# EAGLE design esp12e (EAGLE 6.5.0)
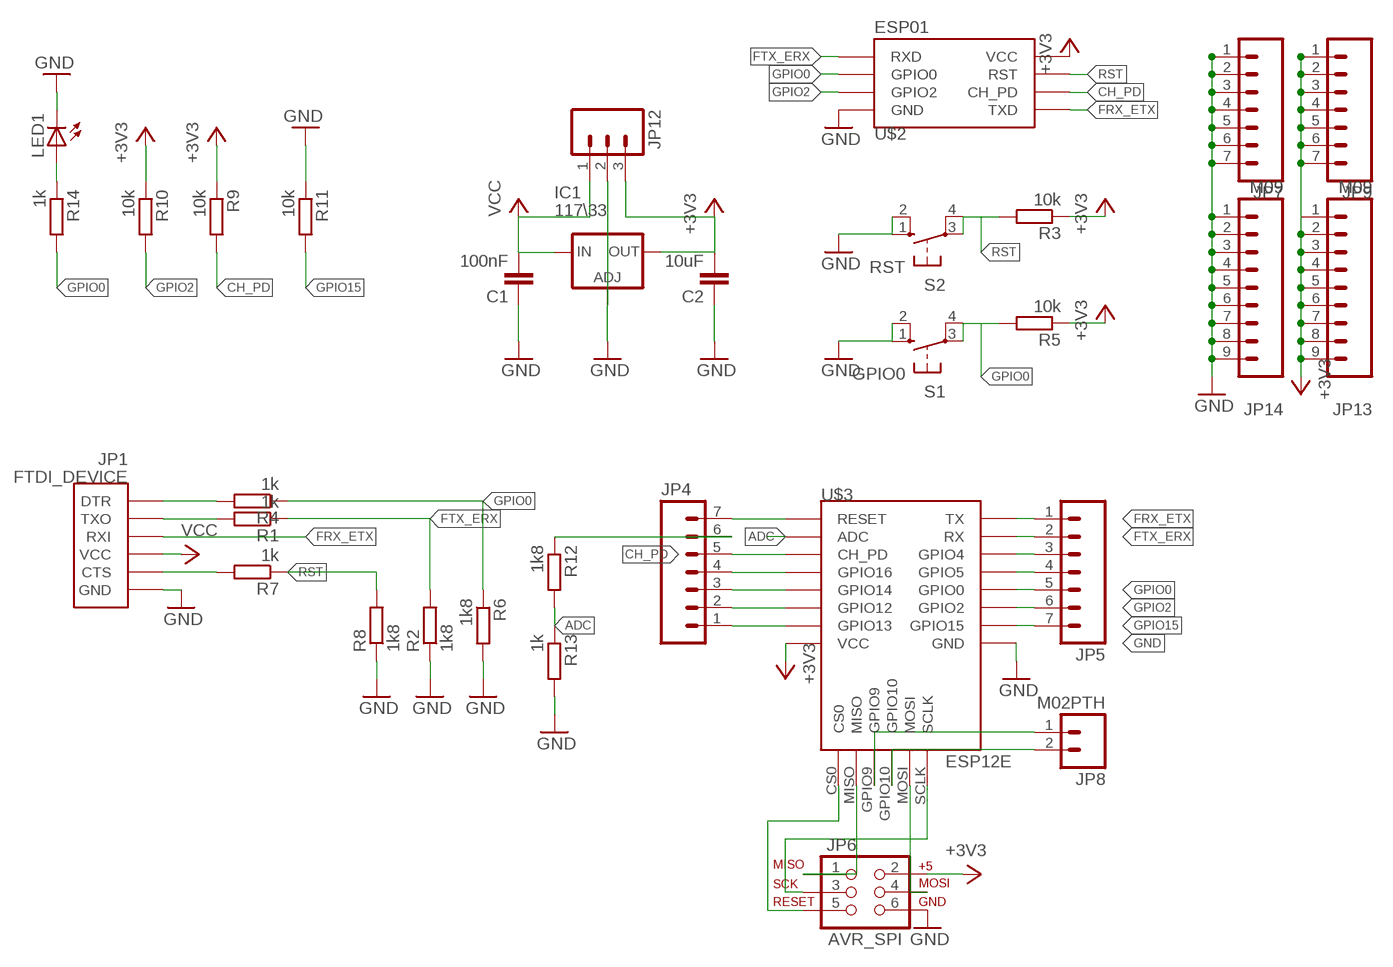
[diagram p0: schematic, sheet 1]

## Parts
C1  100nF  C-EUC1206  [C1206]
C2  10uF  C-EUC1206  [C1206]
IC1  117\33  LD117AS33TR  [SOT223]
JP1  FTDI_DEVICE  [FTDI_DEVICE_SIDE]
JP4  M07  [1X07]
JP5  M07  [1X07]
JP6  AVR_SPI  AVR_SPI_PRG_6NS  [2X3-NS]
JP7  M07  [1X07]
JP8  M02PTH  [1X02]
JP9  M07  [1X07]
JP12  M03PTH  [1X03]
JP13  M09  [1X09]
JP14  M09  [1X09]
LED1  LEDSMT1206  [1206]
R1  1k  R-EU_M1206  [M1206]
R2  1k8  R-EU_M1206  [M1206]
R3  10k  R-EU_M1206  [M1206]
R4  1k  R-EU_M1206  [M1206]
R5  10k  R-EU_M1206  [M1206]
R6  1k8  R-EU_M1206  [M1206]
R7  1k  R-EU_M1206  [M1206]
R8  1k8  R-EU_M1206  [M1206]
R9  10k  R-EU_M1206  [M1206]
R10  10k  R-EU_M1206  [M1206]
R11  10k  R-EU_M1206  [M1206]
R12  1k8  R-EU_M1206  [M1206]
R13  1k  R-EU_M1206  [M1206]
R14  1k  R-EU_M1206  [M1206]
S1  GPIO0  10-XX  [B3F-10XX]
S2  RST  10-XX  [B3F-10XX]
U$2  ESP01  [ESP01]
U$3  ESP12E  [ESP12E]

## Nets
+3V3: C2.2 IC1.4(OUT) JP6.2 JP9.1 JP9.2 JP9.3 JP9.4 JP9.5 JP9.6 JP9.7 JP12.3 JP13.1 JP13.2 JP13.3 JP13.4 JP13.5 JP13.6 JP13.7 JP13.8 JP13.9 R3.1 R5.1 R9.1 R10.1 U$2.VCC U$3.VCC
ADC: R12.2 R13.1 U$3.ADC
CH_PD: JP4.5 R9.2 U$2.CH_PD U$3.CH_PD
FRX_ETX: JP1.P$3(RXI) JP5.1 U$2.TX(TXD) U$3.TX
FTX_ERX: JP5.2 R1.1 R2.2 U$2.RX(RXD) U$3.RX
GND: C1.1 C2.1 IC1.1(ADJ) JP1.P$6(GND) JP6.6 JP7.1 JP7.2 JP7.3 JP7.4 JP7.5 JP7.6 JP7.7 JP12.2 JP14.1 JP14.2 JP14.3 JP14.4 JP14.5 JP14.6 JP14.7 JP14.8 JP14.9 LED1.C R2.1 R6.2 R8.1 R11.1 R13.2 S1.1(S) S1.2(S1) S2.1(S) S2.2(S1) U$2.GND U$3.GND
GPIO0: JP5.5 R4.1 R5.2 R6.1 R14.2 S1.3(P) S1.4(P1) U$2.GPIO0 U$3.GPIO0
GPIO2: JP5.6 R10.2 U$2.GPIO2 U$3.GPIO2
GPIO15: JP5.7 R11.2 U$3.GPIO15
N$1: JP1.P$5(CTS) R7.2
N$2: JP1.P$2(TXO) R1.2
N$3: JP4.1 U$3.GPIO13
N$4: JP4.2 U$3.GPIO12
N$5: JP4.3 U$3.GPIO14
N$6: JP1.P$1(DTR) R4.2
N$7: JP4.4 U$3.GPIO16
N$8: LED1.A R14.1
N$9: JP4.6 R12.1
N$10: JP6.1 U$3.MISO
N$11: JP6.4 U$3.MOSI
N$12: JP6.3 U$3.SCLK
N$13: JP6.5 U$3.CS0
N$14: JP5.4 U$3.GPIO5
N$15: JP5.3 U$3.GPIO4
N$16: JP8.1 U$3.GPIO9
N$17: JP8.2 U$3.GPIO10
RST: JP4.7 R3.2 R7.1 R8.2 S2.3(P) S2.4(P1) U$2.RST U$3.RESET
VCC: C1.2 IC1.3(IN) JP1.P$4(VCC) JP12.1

## Library data of the parts
C1 C2 = resistor:C-EU: CAPACITOR, European symbol
IC1 = v-reg:LD117A?*: Low drop fixed and adjustable positive voltage regulators 1 A Source: http://www.st.com/stonline/products/literature/ds/7194/ld1117axx.pdf
JP1 = SparkFun-Connectors:FTDI_DEVICE: Connector which mates to FTDI basic or FTDI cable.
JP4 JP5 JP7 JP9 = SparkFun-Connectors:M07: Header 7 Standard 7-pin 0.1" header. Use with straight break away headers (SKU : PRT-00116), right angle break away headers (PRT-00553), swiss pins (PRT-00743), machine pins (PRT-00117), and female headers (PRT-00115). NOTES ON THE VARIANTS LOCK and LOCK_LONGPADS... This footprint was designed to help hold the alignment of a through-hole component (i.e. 7-pin header) while soldering it into place. You may notice that each hole has been shifted either up or down by 0.005 of an inch from it's more standard position (which is usually a perfectly straight line). This slight alteration caused the pins (the squares in the middle) to touch the edges of the holes. Because they are alternating, it causes a "brace" to hold the header in place. 0.005 has proven to be the perfect amount of "off-center" position when using our standard breakaway headers. Although looks a little odd when you look at the bare footprint, once you have a header in there, the alteration is very hard to notice. Also, if you push a header all the way into place, it is covered up entirely on the bottom side. This idea of altering the position of holes to aid alignment will be further integrated into the Sparkfun Library for other footprints. It can help hold any component with 3 or more connection pins.
JP6 = SparkFun-Connectors:AVR_SPI_PRG_6: AVR ISP 6 Pin This is the reduced ISP connector for AVR programming. Common on Arduino. This footprint will take up less PCB space and can be used with a 10-pin to 6-pin adapter such as SKU: BOB-08508 **Special note about "TEST_POINT" package. The stop mask is on the top side, so if you want your programming test points to be on the bottom of your board, make sure to place this package on the bottom side of the board. This also ensure that the orientation to program from the bottom side will be correct.
JP8 = SparkFun-Connectors:M02: Standard 2-pin 0.1" header. Use with - straight break away headers ( PRT-00116) - right angle break away headers (PRT-00553) - swiss pins (PRT-00743) - machine pins (PRT-00117) - female headers (PRT-00115) Molex polarized connector foot print use with: PRT-08233 with associated crimp pins and housings. 2.54_SCREWTERM for use with PRT-10571. 3.5mm Screw Terminal footprints for PRT-08084 5mm Screw Terminal footprints for use with PRT-08432
JP12 = SparkFun-Connectors:M03: Header 3 Standard 3-pin 0.1" header. Use with straight break away headers (SKU : PRT-00116), right angle break away headers (PRT-00553), swiss pins (PRT-00743), machine pins (PRT-00117), and female headers (PRT-00115). Molex polarized connector foot print use with SKU : PRT-08232 with associated crimp pins and housings.
JP13 JP14 = SparkFun-Connectors:M09: Header 9 Standard 9-pin 0.1" header. Use with straight break away headers (SKU : PRT-00116), right angle break away headers (PRT-00553), swiss pins (PRT-00743), machine pins (PRT-00117), and female headers (PRT-00115).
LED1 = led:LED: LED OSRAM: - CHIPLED LG R971, LG N971, LY N971, LG Q971, LY Q971, LO R971, LY R971 LH N974, LH R974 LS Q976, LO Q976, LY Q976 LO Q996 - Hyper CHIPLED LW Q18S LB Q993, LB Q99A, LB R99A - SideLED LS A670, LO A670, LY A670, LG A670, LP A670 LB A673, LV A673, LT A673, LW A673 LH A674 LY A675 LS A676, LA A676, LO A676, LY A676, LW A676 LS A679, LY A679, LG A679 - Hyper Micro SIDELED® LS Y876, LA Y876, LO Y876, LY Y876 LT Y87S - SmartLED LW L88C, LW L88S LB L89C, LB L89S, LG L890 LS L89K, LO L89K, LY L89K LS L896, LA L896, LO L896, LY L896 - TOPLED LS T670, LO T670, LY T670, LG T670, LP T670 LSG T670, LSP T670, LSY T670, LOP T670, LYG T670 LG T671, LOG T671, LSG T671 LB T673, LV T673, LT T673, LW T673 LH T674 LS T676, LA T676, LO T676, LY T676, LB T676, LH T676, LSB T676, LW T676 LB T67C, LV T67C, LT T67C, LS T67K, LO T67K, LY T67K, LW E67C LS E67B, LA E67B, LO E67B, LY E67B, LB E67C, LV E67C, LT E67C LW T67C LS T679, LY T679, LG T679 LS T770, LO T770, LY T770, LG T770, LP T770 LB T773, LV T773, LT T773, LW T773 LH T774 LS E675, LA E675, LY E675, LS T675 LS T776, LA T776, LO T776, LY T776, LB T776 LHGB T686 LT T68C, LB T68C - Hyper Mini TOPLED® LB M676 - Mini TOPLED Santana® LG M470 LS M47K, LO M47K, LY M47K Source: http://www.osram.convergy.de LUXEON: - LUMILED® LXK2-PW12-R00, LXK2-PW12-S00, LXK2-PW14-U00, LXK2-PW14-V00 LXK2-PM12-R00, LXK2-PM12-S00, LXK2-PM14-U00 LXK2-PE12-Q00, LXK2-PE12-R00, LXK2-PE12-S00, LXK2-PE14-T00, LXK2-PE14-U00 LXK2-PB12-K00, LXK2-PB12-L00, LXK2-PB12-M00, LXK2-PB14-N00, LXK2-PB14-P00, LXK2-PB14-Q00 LXK2-PR12-L00, LXK2-PR12-M00, LXK2-PR14-Q00, LXK2-PR14-R00 LXK2-PD12-Q00, LXK2-PD12-R00, LXK2-PD12-S00 LXK2-PH12-R00, LXK2-PH12-S00 LXK2-PL12-P00, LXK2-PL12-Q00, LXK2-PL12-R00 Source: www.luxeon.com KINGBRIGHT: KA-3528ASYC Source: www.kingbright.com
R1-R14 = resistor:R-EU_: RESISTOR, European symbol
S1 S2 = switch-omron:10-XX: OMRON SWITCH; MPN: B3F-1000; OC_FARNELL: 176432; OC_NEWARK: 36M3542
U$2 = esp8266modules:ESP01: ESP8266 Wifi module 01
U$3 = esp8266modules:ESP12E

## Board
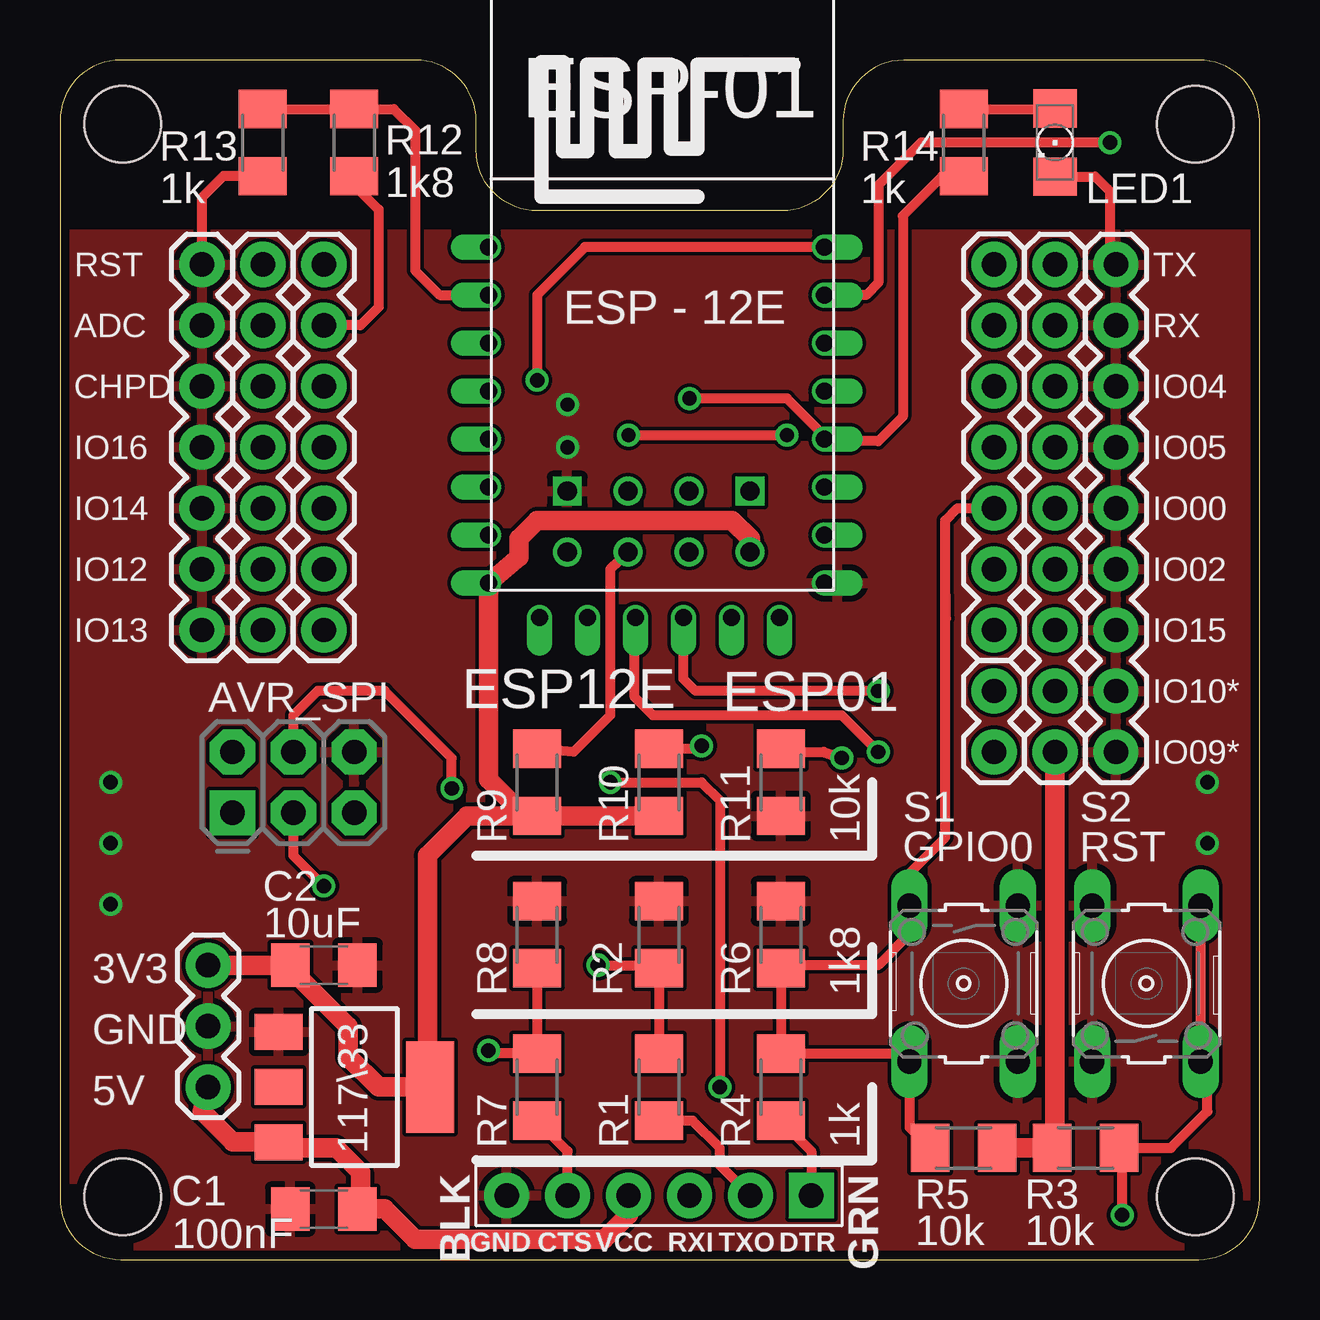
[diagram p1: board, top side]
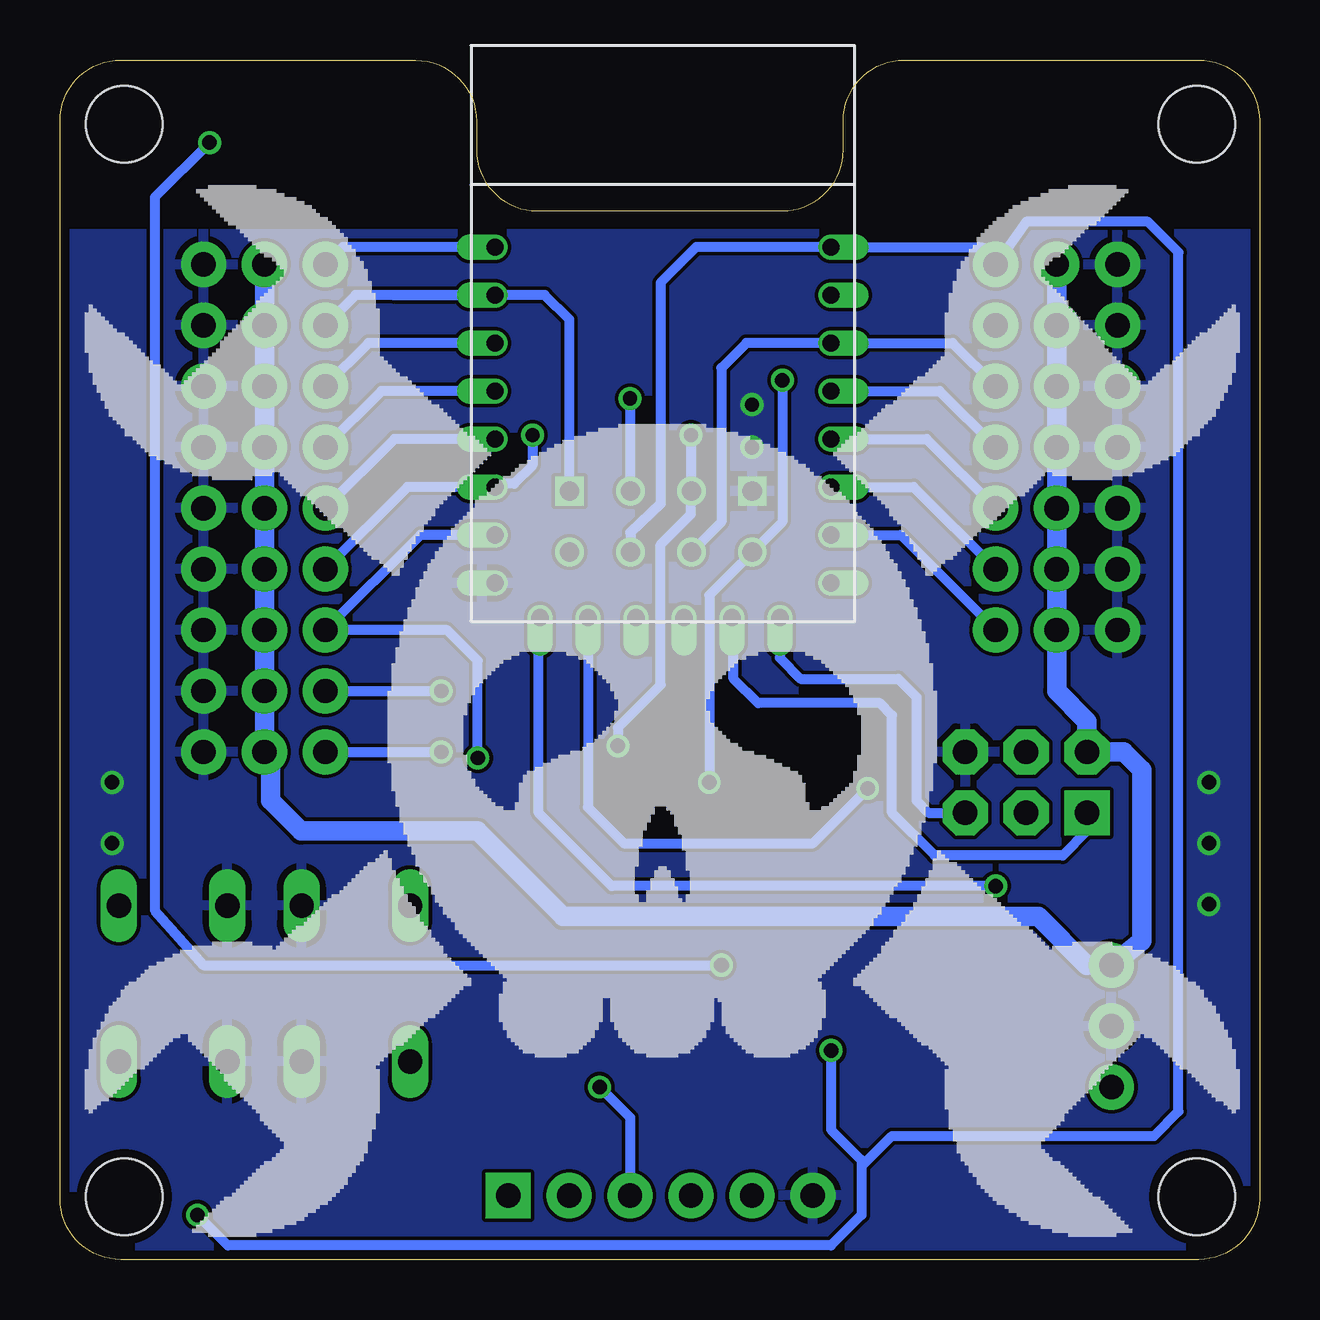
[diagram p2: board, bottom side, seen from below]

Size 50 x 50 mm. Coordinates in mm from the lower left corner, seen from the top.
Outline: 0,47.46 0,2.54 arc90 2.54,0 47.46,0 arc90 50,2.54 50,47.46 arc90 47.46,50 35.18,49.99 arc90 32.64,47.45 32.64,46.25 arc-90 30.1,43.71 19.89,43.71 arc-90 17.35,46.25 17.35,47.46 arc90 14.81,50 2.54,50 arc90 0,47.46
Copper layers (1*16): Top 0.0356mm / dielectric 1.5011mm / Bottom 0.0356mm
Design rules "LaenPCBOrder *": minimum track width 6mil, minimum drill 13mil, track to track 6mil, track to pad 6mil, pad to pad 6mil, via to via 6mil, smd to smd 6mil, copper to edge 15mil, drill to drill 6mil, minimum pad ring 7mil, minimum via ring 7mil, stop-mask expansion 3mil, vias tented up to drill 2000mil, thermal gap 10mil
Holes 3.2 mm at 2.62,47.32 2.62,2.62 47.32,2.62 47.32,47.32

### Footprints (pad centres in the part's own frame; a part is rotated, then mirrored left to right if it is on the bottom)
C1206 = smd 1.6 x 1.8: 1 -1.4,0; 2 1.4,0
SOT223 = smd 1.5 x 2: 1 -2.3,-3.15; 2 0,-3.15; 3 2.3,-3.15 | smd 3.8 x 2: 4 0,3.15
FTDI_DEVICE_SIDE = drill 1.016 pad 1.88 square: P$1 -6.35,0 | drill 1.016 pad 1.88: P$2 -3.81,0; P$3 -1.27,0; P$4 1.27,0; P$5 3.81,0; P$6 6.35,0
1X07 = drill 1.016 pad 1.88: 1 0,0; 2 2.54,0; 3 5.08,0; 4 7.62,0; 5 10.16,0; 6 12.7,0; 7 15.24,0
2X3-NS = drill 1.016 pad 1.88 square: 1 -2.54,-1.27 | drill 1.016 pad 1.88 octagon: 2 -2.54,1.27; 3 0,-1.27; 4 0,1.27; 5 2.54,-1.27; 6 2.54,1.27
1X02 = drill 1.016 pad 1.88: 1 0,0; 2 2.54,0
1X03 = drill 1.016 pad 1.88: 1 0,0; 2 2.54,0; 3 5.08,0
1X09 = drill 1.016 pad 1.88: 1 0,0; 2 2.54,0; 3 5.08,0; 4 7.62,0; 5 10.16,0; 6 12.7,0; 7 15.24,0; 8 17.78,0; 9 20.32,0
1206 = smd 1.6 x 1.803: A -1.422,0; C 1.422,0
M1206 = smd 1.6 x 2: 1 -1.4,0; 2 1.4,0
B3F-10XX = drill 1.016 long: 1 -3.251,2.261; 2 3.251,2.261; 3 -3.251,-2.261; 4 3.251,-2.261
ESP01 = drill 0.8: CH_PD -1.285,-8.178; GPIO0 1.255,-5.638; GPIO2 -1.285,-5.638; RST 1.255,-8.178; TX -3.825,-8.178; VCC 3.795,-8.178 | drill 0.8 square: GND -3.825,-5.638; RX 3.795,-5.638
ESP12E = drill 0.7 offset: ADC -7.1,3.8; CH_PD -7.1,1.8; CS0 -4.975,-9.64; GND 6.9,-8.2; GPIO0 6.9,-2.2; GPIO2 6.9,-4.2; GPIO4 6.9,1.8; GPIO5 6.9,-0.2; GPIO9 -0.975,-9.64; GPIO10 1.025,-9.64; GPIO12 -7.1,-4.2; GPIO13 -7.1,-6.2; GPIO14 -7.1,-2.2; GPIO15 6.9,-6.2; GPIO16 -7.1,-0.2; MISO -2.975,-9.64; MOSI 3.025,-9.64; RESET -7.1,5.8; RX 6.9,3.8; SCLK 5.025,-9.64; TX 6.9,5.8; VCC -7.1,-8.2

### Placement (x,y rotation side)
C1  11,2.11 0 top
C2  11,12.27 180 top
IC1  12.27,7.19 270 top
JP1  24.97,2.67 180 top
JP4  11,26.24 90 top
JP5  38.94,41.48 270 top
JP6  9.73,19.89 0 top
JP7  5.92,26.24 90 top
JP8  38.94,21.16 90 top
JP9  8.46,26.24 90 top
JP12  6.17,7.19 90 top
JP13  41.48,21.16 90 top
JP14  44.02,21.16 90 top
LED1  41.48,46.56 270 top
R1  24.97,7.19 270 top
R2  24.97,13.54 270 top
R3  42.75,4.65 0 top
R4  30.05,7.19 270 top
R5  37.67,4.65 180 top
R6  30.05,13.54 90 top
R7  19.89,7.19 270 top
R8  19.89,13.54 270 top
R9  19.89,19.89 90 top
R10  24.97,19.89 90 top
R11  30.05,19.89 90 top
R12  12.27,46.56 90 top
R13  8.46,46.56 270 top
R14  37.67,46.56 270 top
S1  37.67,11.51 270 top
S2  45.29,11.51 90 top
U$2  24.97,37.67 0 top
U$3  24.97,36.4 0 top

### Tracks (layer width: path | path; a pad name or v marks a point on that pad's centre or on a via)
+3V3
  Top 0.406: C2.2 9.6,12.14 | 41.48,4.78 R3.1 | R9.1 19.38,18.49 | 15.32,7.29 IC1.4
  Top 0.813: C2.2 JP12.3 | 9.6,12.14 12.01,9.73 12.01,8.46 13.28,7.19 IC1.4 | JP13.1 41.48,4.78 | R3.1 R5.1 | R10.1 R9.1 | 15.32,7.29 15.32,16.84 16.96,18.49 19.38,18.49 17.87,20 U$3.VCC 19.13,29.29 19.13,30.05 19.89,30.81 28.02,30.81 28.78,30.05 U$2.VCC
  Bottom 0.254: 39.95,17.86 40.21,17.86 41.48,19.13 JP13.1
  Bottom 0.406: 7.19,12.27 JP12.3
  Bottom 0.813: JP13.9 JP13.8 JP13.7 JP13.6 JP13.5 JP13.4 JP13.3 JP13.2 JP13.1 | 7.19,12.27 9.22,14.3 29.03,14.3 32.59,17.86 39.95,17.86 41.22,19.13 41.22,21.16 | JP9.7 JP9.6 JP9.5 JP9.4 JP9.3 JP9.2 JP9.1 8.46,23.7 7.19,22.43 JP6.2 5.66,21.16 4.9,20.4 4.9,13.28 JP12.3
ADC
  Top 0.406: R13.1 R12.2 13.92,47.96 14.81,47.07 14.81,41.22 15.82,40.21 U$3.ADC
CH_PD
  Top 0.406: U$2.CH_PD 22.94,28.78 22.94,22.68 21.41,21.16 R9.2
  Bottom 0.406: JP4.5 12.8,38.2 U$3.CH_PD 21.39,38.2 22.43,37.16 22.43,30.75 U$2.CH_PD
FRX_ETX  (via drill 0.6)
  Top 0.406: U$3.TX 21.88,42.2 19.89,40.21 v19.89,36.65 | v22.94,19.89 26.75,19.89 27.51,19.13 v27.51,7.19
  Bottom 0.406: U$3.TX 38.22,42.2 JP5.1 | v22.94,19.89 22.94,27.7 U$2.TX 19.89,30.75 v19.89,36.65 | v27.51,7.19 26.24,5.92 JP1.P$3
FTX_ERX  (via drill 0.6, 0.61)
  Top 0.254: 24.97,12.27 R2.2
  Top 0.406: R2.2 R1.1 | v22.43,12.27 24.97,12.27 | v43.76,46.56 35.89,46.56 34.11,44.78 34.11,40.72 33.6,40.2 U$3.RX
  Bottom 0.254: 36.14,40.21 37.67,40.21 37.67,40.2
  Bottom 0.406: JP5.2 37.68,40.2 37.67,40.2 U$3.RX 29.79,40.21 28.76,39.18 U$2.RX | v22.43,12.27 44.02,12.27 46.05,14.55 46.05,44.27 v43.76,46.56 | 36.14,40.21 32.59,40.21
GND  (via drill 0.6)
  Top 0.406: R13.2 6.8,45.16 5.92,44.27 JP7.7 | LED1.C 43.15,45.14 43.76,44.53 43.76,41.73 JP14.9 | R11.1 30.17,18.36 | 33.17,28.2 U$3.GND
  other vias: 21.16,35.64 21.16,33.86 2.11,17.35 2.11,19.89 2.11,14.81 47.83,17.35 47.83,19.89
  pour Top: -5.51,42.75 55.45,42.75 55.45,-5.51 -5.51,-5.51
  pour Bottom: -2.97,42.75 52.91,42.75 52.91,-2.97 -2.97,-2.97
GPIO0  (via drill 0.6)
  Top 0.406: R14.2 36.78,45.16 35.13,43.51 35.13,35.13 34.11,34.11 31.95,34.11 U$3.GPIO0 31.87,34.32 30.3,35.89 v26.24,35.89 | R5.2 35.41,5.51 S1.4 35.07,8.59 R4.1 R6.1 30.18,12.27 34.11,12.27 35.41,13.56 S1.3 35.41,16.1 36.91,17.6 36.91,28.78 | 36.93,26.72 36.91,28.78 | 36.91,28.78 36.91,30.81 37.41,31.32 38.18,31.32 38.56,31.7 JP5.5
  Bottom 0.406: U$3.GPIO0 36.06,34.2 JP5.5 | v26.24,35.89 26.24,32.05 U$2.GPIO0
GPIO2  (via drill 0.6)
  Top 0.406: v23.7,34.37 v30.3,34.37 | v26.75,21.41 26.62,21.29 R10.2
  Bottom 0.406: JP5.6 35.52,32.2 U$3.GPIO2 31.73,32.33 31.06,32.33 30.3,33.1 v30.3,34.37 | v23.7,34.37 23.68,34.35 U$2.GPIO2 23.7,31.06 24.97,29.79 24.97,23.95 26.75,22.17 v26.75,21.41
GPIO15  (via drill 0.6)
  Top 0.406: R11.2 30.18,21.16 31.83,21.16 v32.59,20.9
  Bottom 0.406: U$3.GPIO15 34.98,30.2 JP5.7 33.86,26.24 32.59,24.97 v32.59,20.9
N$1
  Top 0.406: JP1.P$5 21.16,4.52 R7.2
N$2
  Top 0.406: JP1.P$2 27.51,3.94 27.51,4.65 26.37,5.79 R1.2
N$3
  Bottom 0.406: U$3.GPIO13 14.96,30.2 JP4.1
N$4
  Bottom 0.406: U$3.GPIO12 14.42,32.2 JP4.2
N$5
  Bottom 0.406: U$3.GPIO14 13.88,34.2 JP4.3
N$6
  Top 0.406: R4.2 31.32,4.52 JP1.P$1
N$7
  Bottom 0.406: U$3.GPIO16 13.34,36.2 JP4.4
N$8
  Top 0.406: R14.1 41.46,47.96 LED1.A
N$9
  Top 0.406: R12.1 12.27,44.78 13.28,43.76 13.28,39.7 12.52,38.94 JP4.6
N$10
  Bottom 0.406: JP6.1 7.19,17.86 8.2,16.84 13.54,16.84 15.32,18.62 15.32,22.68 15.82,23.19 20.9,23.19 21.92,24.21 21.92,26.69 U$3.MISO
N$11  (via drill 0.6)
  Top 0.406: v16.33,19.63 16.33,20.9 13.54,23.7 10.74,23.7 9.73,22.68 JP6.4
  Bottom 0.406: U$3.MOSI 27.99,18.85 26.49,17.35 18.62,17.35 v16.33,19.63
N$12  (via drill 0.6)
  Top 0.406: JP6.3 9.73,16.84 v11,15.57
  Bottom 0.406: v11,15.57 27,15.57 30.05,18.62 30.05,26.7 U$3.SCLK
N$13
  Bottom 0.406: U$3.CS0 19.99,25.07 19.13,24.21 15.06,24.21 14.3,23.44 14.3,19.13 13.79,18.62 JP6.5
N$14
  Bottom 0.406: U$3.GPIO5 36.6,36.2 JP5.4
N$15
  Bottom 0.406: U$3.GPIO4 37.14,38.2 JP5.3
N$16  (via drill 0.6)
  Top 0.406: v34.11,21.16 32.59,22.68 24.71,22.68 23.95,23.44 23.95,26.72 U$3.GPIO9
  Bottom 0.406: JP8.1 v34.11,21.16
N$17  (via drill 0.6)
  Top 0.406: v34.11,23.7 26.49,23.7 25.98,24.21 U$3.GPIO10
  Bottom 0.406: JP8.2 v34.11,23.7
RST  (via drill 0.6)
  Top 0.406: S2.4 S2.3 47.83,7.98 47.83,6.17 46.3,4.65 R3.2 44.27,4.52 v44.27,1.85 | R8.2 R7.1 17.98,8.59 v17.86,8.71
  Bottom 0.254: 16.59,3.38 16.46,4.01
  Bottom 0.406: U$2.RST 26.22,30.29 26.24,30.3 24.97,31.51 24.97,40.72 23.49,42.2 U$3.RESET 11.72,42.2 arc90 JP4.7 9.73,43.26 4.65,43.26 3.38,41.99 3.38,6.17 4.39,5.16 15.32,5.16 16.46,4.01 16.59,4.14 | v17.86,8.71 17.86,5.41 16.59,4.14 | 16.59,4.14 16.59,3.38 16.59,1.85 17.86,0.58 43,0.58 v44.27,1.85
VCC
  Top 0.406: 9.1,4.9 IC1.3 9.49,4.89 9.73,4.65 | 12.52,2.23 C1.2
  Top 0.813: JP12.1 5.92,6.17 7.19,4.9 9.1,4.9 | 9.73,4.65 11.51,4.65 12.52,3.63 12.52,2.23 | C1.2 13.54,2.11 14.81,0.84 22.68,0.84 23.7,1.85 JP1.P$4

### Text on the board
tNames: RST | TX | ADC | RX | CHPD | IO04 | IO16 | IO05 | IO14 | IO00 | IO12 | IO02 | IO13 | IO15 | IO10* | IO09* | 3V3 | GND | 5V